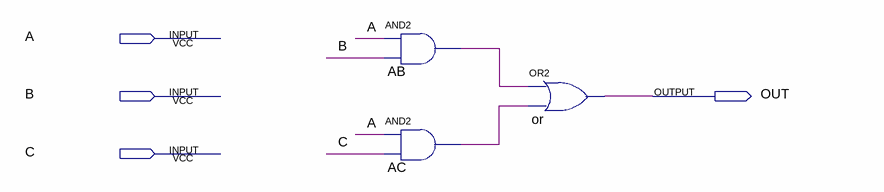
[diagram p0: schematic sheet]
// Quartus schematic decod_decenas.bdf as structural Verilog: 3 symbols, 4 pins
module decod_decenas (
  input  A,
  input  B,
  input  C,
  output OUT
);

  wire AB_out, AC_out;

  and AB (AB_out, A, B);
  and AC (AC_out, A, C);
  or \or  (OUT, AB_out, AC_out);
endmodule
